# EAGLE design front (EAGLE 6.5.0)
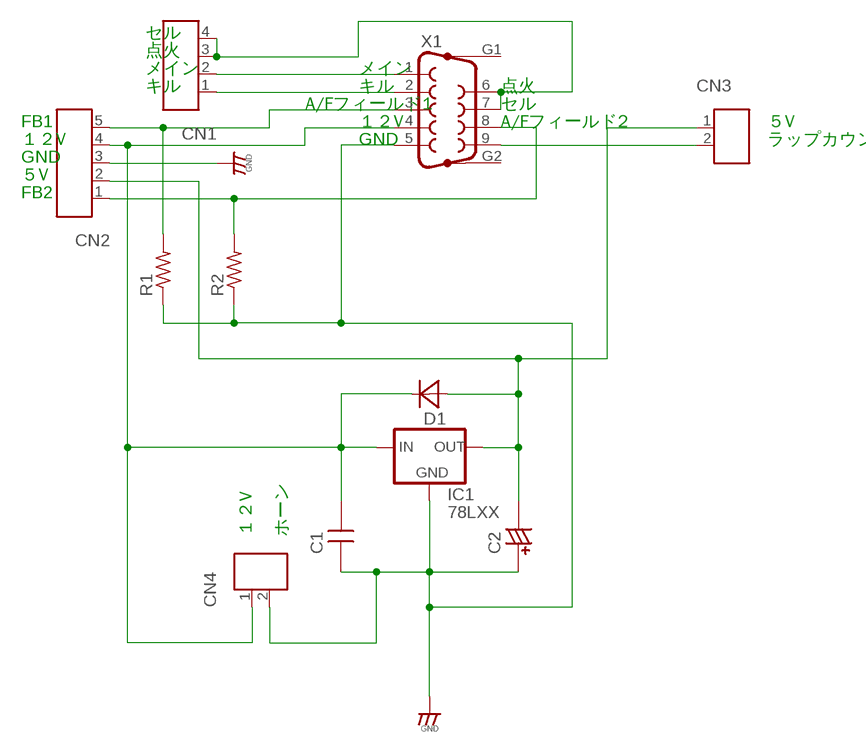
[diagram p0: schematic, sheet 1]

## Parts
C1  CAPDIP_1  [CAP_DIP_1]
C2  CCAP6.5  [CCAP_6.5]
CN1  CON_4P  [CON_HRS_DIP_4]
CN2  CON_5P  [CON_HRS_DIP_5]
CN3  CON_2P  [CON_HRS_DIP_2]
CN4  CON_2P  [CON_HRS_DIP_2]
D1  DIODEGENERIC_2  [DIODE_2]
IC1  78LXX  [TO92-VREG-78L]
R1  R-US_0207/7  [0207/7]
R2  R-US_0207/7  [0207/7]
X1  F09HP  [F09HP]

## Nets
N$1: CN1.2 X1.1
N$2: CN1.1 X1.2
N$3: CN2.5 R1.2 X1.3
N$4: CN2.1 R2.2 X1.8
N$5: CN1.3 CN1.4 X1.6 X1.7
N$6: CN3.2 X1.9
N$7: C1.2 CN2.4 CN4.1 D1.K IC1.I(IN) X1.4
N$8: C1.1 C2.+ CN2.3 CN4.2 IC1.G(GND) R1.1 R2.1 X1.5 ; supply symbol labelled GND
N$10: C2.- CN2.2 CN3.1 D1.A IC1.O(OUT)
Unconnected: X1.G1 X1.G2

## Notes on the sheet
- セル
- 点火
- メイン | メイン
- キル | キル | 点火
- A/Fフィールド1 | セル
- FB1 | １２V | A/Fフィールド2 | ５V
- １２V | GND | ラップカウンタ2
- GND
- ５V
- FB2
- １２V | ホーン

## Library data of the parts
C1 = da_parts:CAP: Non polar capacitor
C2 = da_parts:CCAP: Polar capacitor
CN1 = da_parts:CON_4P
CN2 = da_parts:CON_5P
CN3 CN4 = da_parts:CON_2P
D1 = da_parts:DIODE
IC1 = da_parts:78LXX
R1 R2 = resistor:R-US_: RESISTOR, American symbol
X1 = con-subd:F09HP: SUB-D; OC_FARNELL: unknown; OC_NEWARK: unknown

## Board
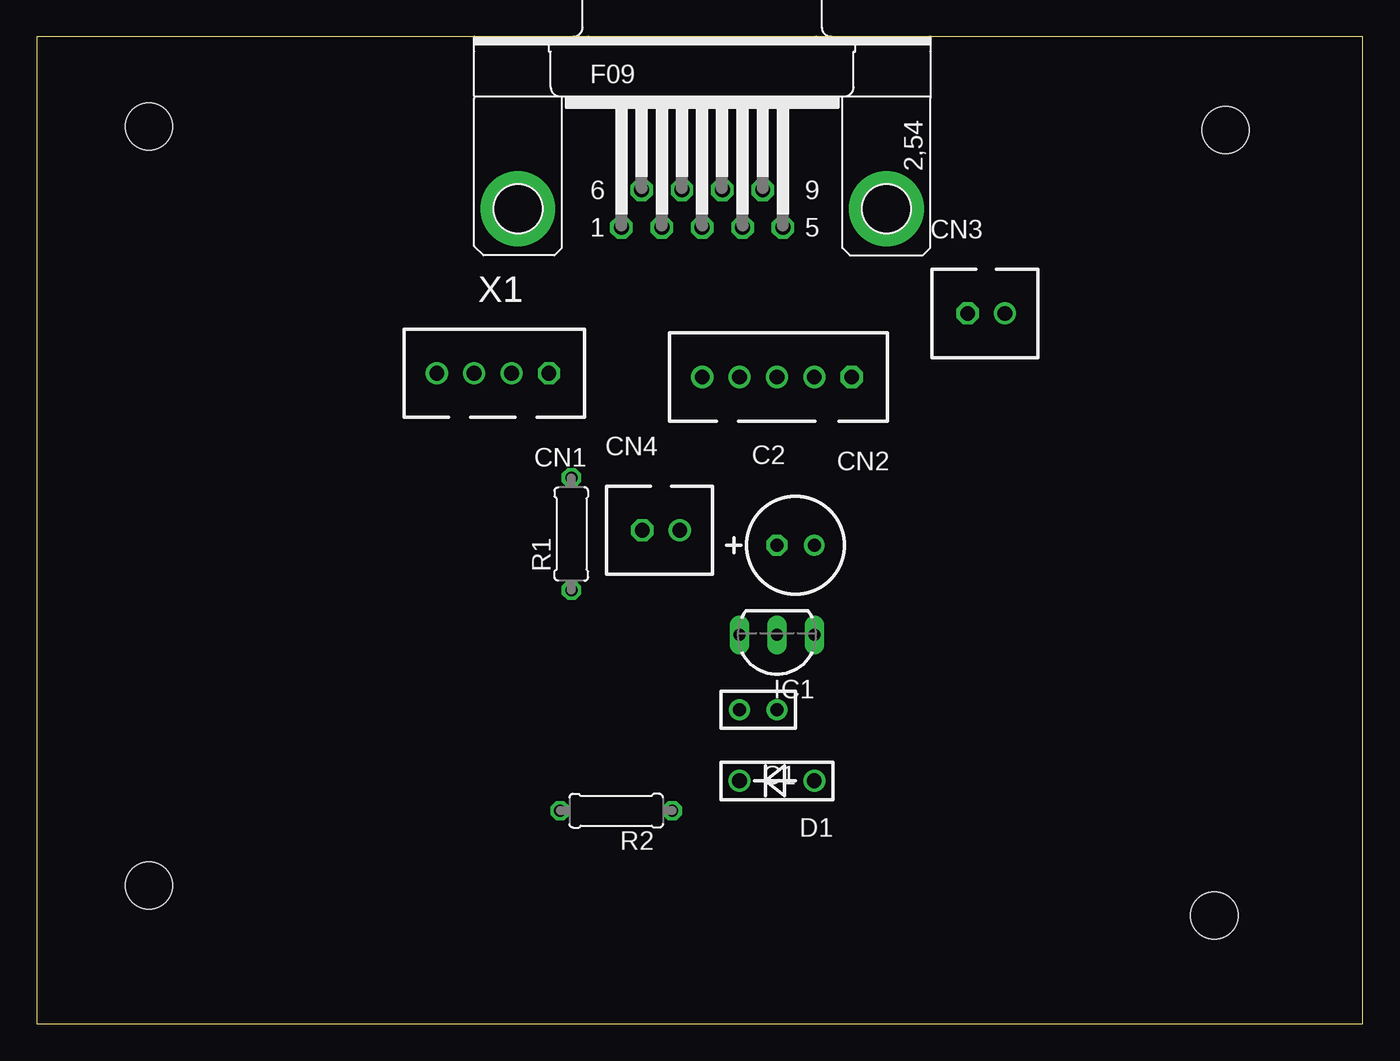
[diagram p1: board, top side]
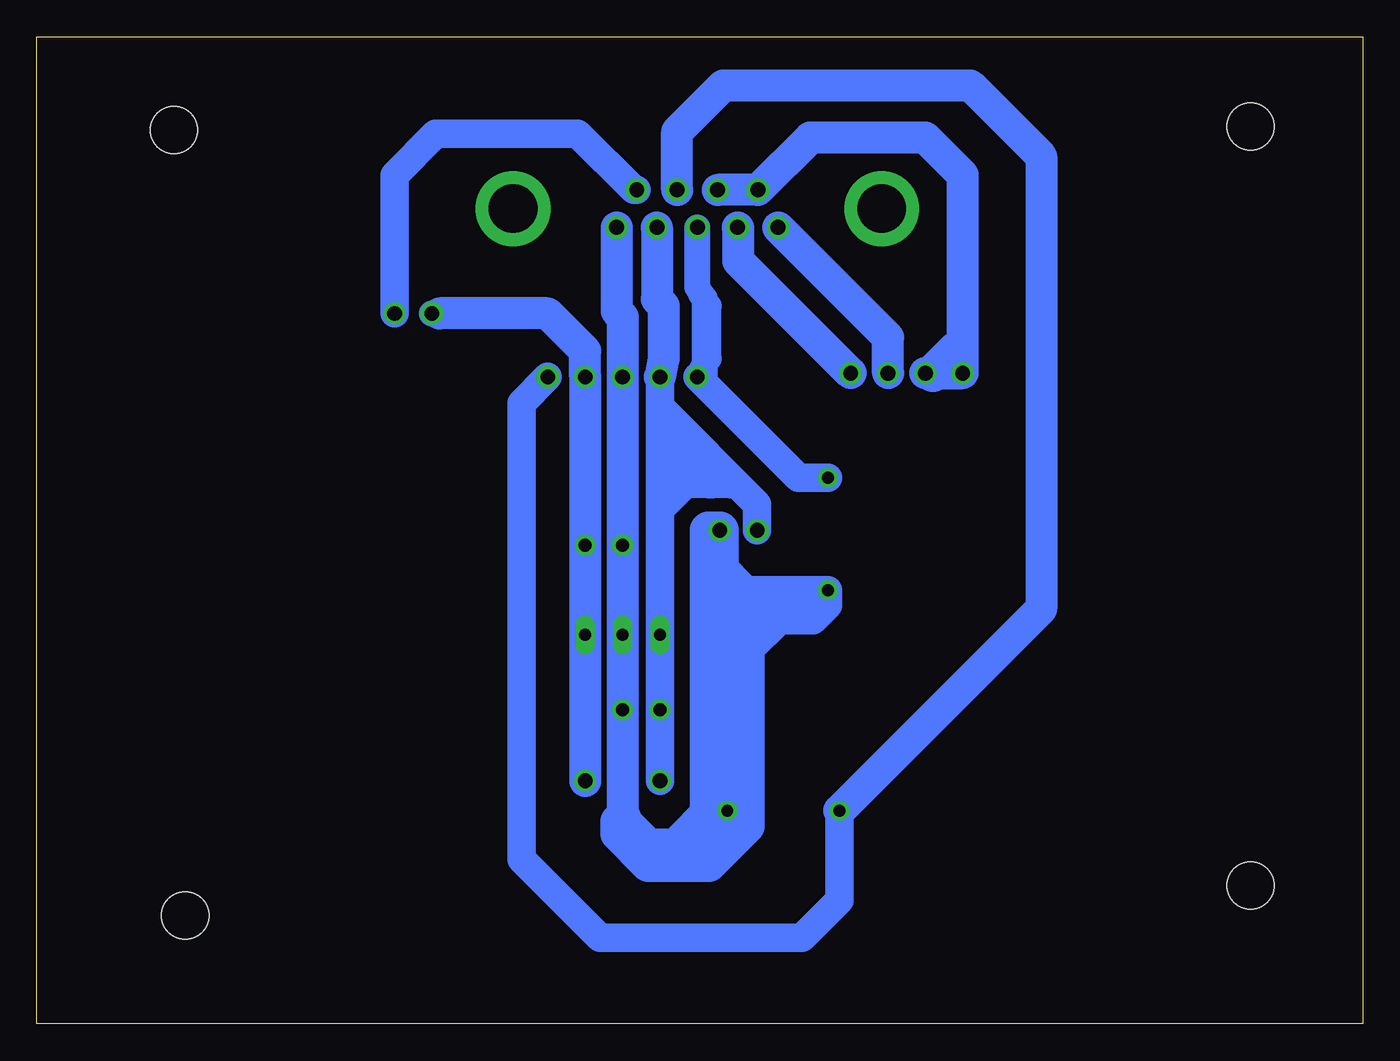
[diagram p2: board, bottom side, seen from below]

Size 90.09 x 67.05 mm. Coordinates in mm from the lower left corner, seen from the top.
Outline: 0,0 90.09,0 90.09,67.05 0,67.05 0,0
Copper layers (1*16): Top 0.035mm / dielectric 1.5mm / Bottom 0.035mm
Design rules "default": minimum track width 10mil, minimum drill 24mil, track to track 8mil, track to pad 8mil, pad to pad 8mil, via to via 8mil, smd to smd 8mil, copper to edge 40mil, drill to drill 8mil, minimum pad ring 10mil, minimum via ring 8mil, stop-mask expansion 4mil, vias tented up to drill 0mil, thermal gap 10mil
Holes 3.2 mm at 7.62,60.96 7.62,9.4 80.01,7.37 80.77,60.71

### Footprints (pad centres in the part's own frame; a part is rotated, then mirrored left to right if it is on the bottom)
CAP_DIP_1 = drill 0.9: 1 -1.27,0; 2 1.27,0
CCAP_6.5 = drill 0.889 octagon: + -1.27,0 | drill 0.889: - 1.27,0
CON_HRS_DIP_4 = drill 1 octagon: 1 -3.81,0 | drill 1: 2 -1.27,0; 3 1.27,0; 4 3.81,0
CON_HRS_DIP_5 = drill 1 octagon: 1 -5.08,0 | drill 1: 2 -2.54,0; 3 0,0; 4 2.54,0; 5 5.08,0
CON_HRS_DIP_2 = drill 1 octagon: 1 -1.27,0 | drill 1: 2 1.27,0
DIODE_2 = drill 1: A -2.54,0; K 2.54,0
TO92-VREG-78L = drill 0.813 long: G 0,0; I 2.54,0; O -2.54,0
0207/7 = drill 0.813 octagon: 1 -3.81,0; 2 3.81,0
F09HP = drill 1.016 octagon: 1 -5.486,-1.27; 2 -2.743,-1.27; 3 0,-1.27; 4 2.743,-1.27; 5 5.486,-1.27; 6 -4.115,1.27; 7 -1.372,1.27; 8 1.372,1.27; 9 4.115,1.27 | drill 3.302 pad 5.08: G1 -12.522,0; G2 12.522,0

### Placement (x,y rotation side)
C1  49.02,21.34 180 top
C2  51.56,32.51 0 top
CN1  30.99,44.2 180 top
CN2  50.29,43.94 180 top
CN3  64.52,48.26 0 top
CN4  42.42,33.53 0 top
D1  50.29,16.51 180 top
IC1  50.29,26.42 180 top
R1  36.32,33.27 90 top
R2  39.37,14.48 180 top
X1  45.21,55.37 0 top

### Tracks (layer width: path | path; a pad name or v marks a point on that pad's centre or on a via)
N$1
  Bottom 2.184: X1.1 32.26,46.63 CN1.2
N$2
  Bottom 2.184: X1.2 42.42,54.05 42.42,51.82 CN1.1
N$3
  Bottom 1.778: CN2.5 44.45,45.21 44.45,48.77 45.21,50.04 X1.3
  Bottom 1.93: R1.2 38.35,37.08 CN2.5
N$4
  Bottom 1.93: R2.2 35.56,8.38 38.1,5.84 51.82,5.84 57.15,11.18 57.15,42.16 CN2.1
  Bottom 2.184: X1.8 46.58,60.6 43.43,63.75 26.67,63.75 21.84,58.93 21.84,28.19 R2.2
N$5
  Bottom 2.184: X1.7 X1.6 37.54,60.2 29.72,60.2 27.18,57.66 CN1.4 CN1.3
N$6
  Bottom 1.93: X1.9 49.53,56.64 53.34,60.45 62.99,60.45 65.79,57.66 CN3.2
N$7
  Bottom 1.422: 45.47,38.86 47.5,38.86 47.75,39.12
  Bottom 1.93: CN2.4 47.75,41.91 | 47.75,41.91 47.75,39.12 IC1.I C1.2 D1.K | CN4.1 41.15,35.31 47.75,41.91
  Bottom 2.184: X1.4 47.95,49.23 47.5,48.77 47.5,45.21 CN2.4
N$8
  Bottom 1.422: 43.69,26.67 41.4,28.96
  Bottom 1.93: R1.1 41.91,29.46 43.69,31.24 CN4.2
  Bottom 2.184: X1.5 50.7,48.41 50.29,48.01 CN2.3 C2.+ IC1.G C1.1 50.29,13.97 48.51,12.19 45.47,12.19 R2.1
  Bottom 2.54: 36.83,28.7 36.83,28.45 37.34,27.94 40.13,27.94 41.91,26.16 41.91,13.46 44.45,10.92 48.51,10.92 50.55,12.95 50.55,13.72 50.29,13.97 | CN4.2 43.69,26.67 43.69,14.99 R2.1
N$9
  Bottom 2.54: 43.94,33.53 44.45,33.53 44.45,12.7 44.7,12.45
N$10
  Bottom 1.778: 62.74,48.26 CN3.1
  Bottom 2.184: D1.A IC1.O C2.- CN2.2 52.83,45.72 55.37,48.26 62.74,48.26
N$11
  Bottom 2.54: 44.2,14.22 44.45,14.22 46.23,12.45
N$12
  Bottom 2.54: 29.21,44.2 27.69,45.72
N$13
  Bottom 1.422: 47.5,36.32 47.5,37.85 46.99,38.35 46.23,39.12
  Bottom 1.778: 46.99,38.35 46.99,37.85
N$14
  Bottom 1.93: 36.32,29.21 36.32,28.45 37.34,27.43 39.62,27.43 41.66,25.4
N$15
  Bottom 1.778: 42.93,36.58 44.2,36.58 | 44.2,36.58 44.45,36.58 | 44.45,36.58 45.97,38.1 45.72,38.1 44.2,36.58 | 44.45,36.58 46.99,36.58
N$16
  Bottom 1.778: 45.97,37.59 45.97,36.58 47.5,35.05
N$17
  Bottom 1.778: 44.7,43.69 44.7,49.28 44.96,49.53